# Altium schematic sheet PIC32ETH.SchDoc: Main
size A3; SheetNumber: 1
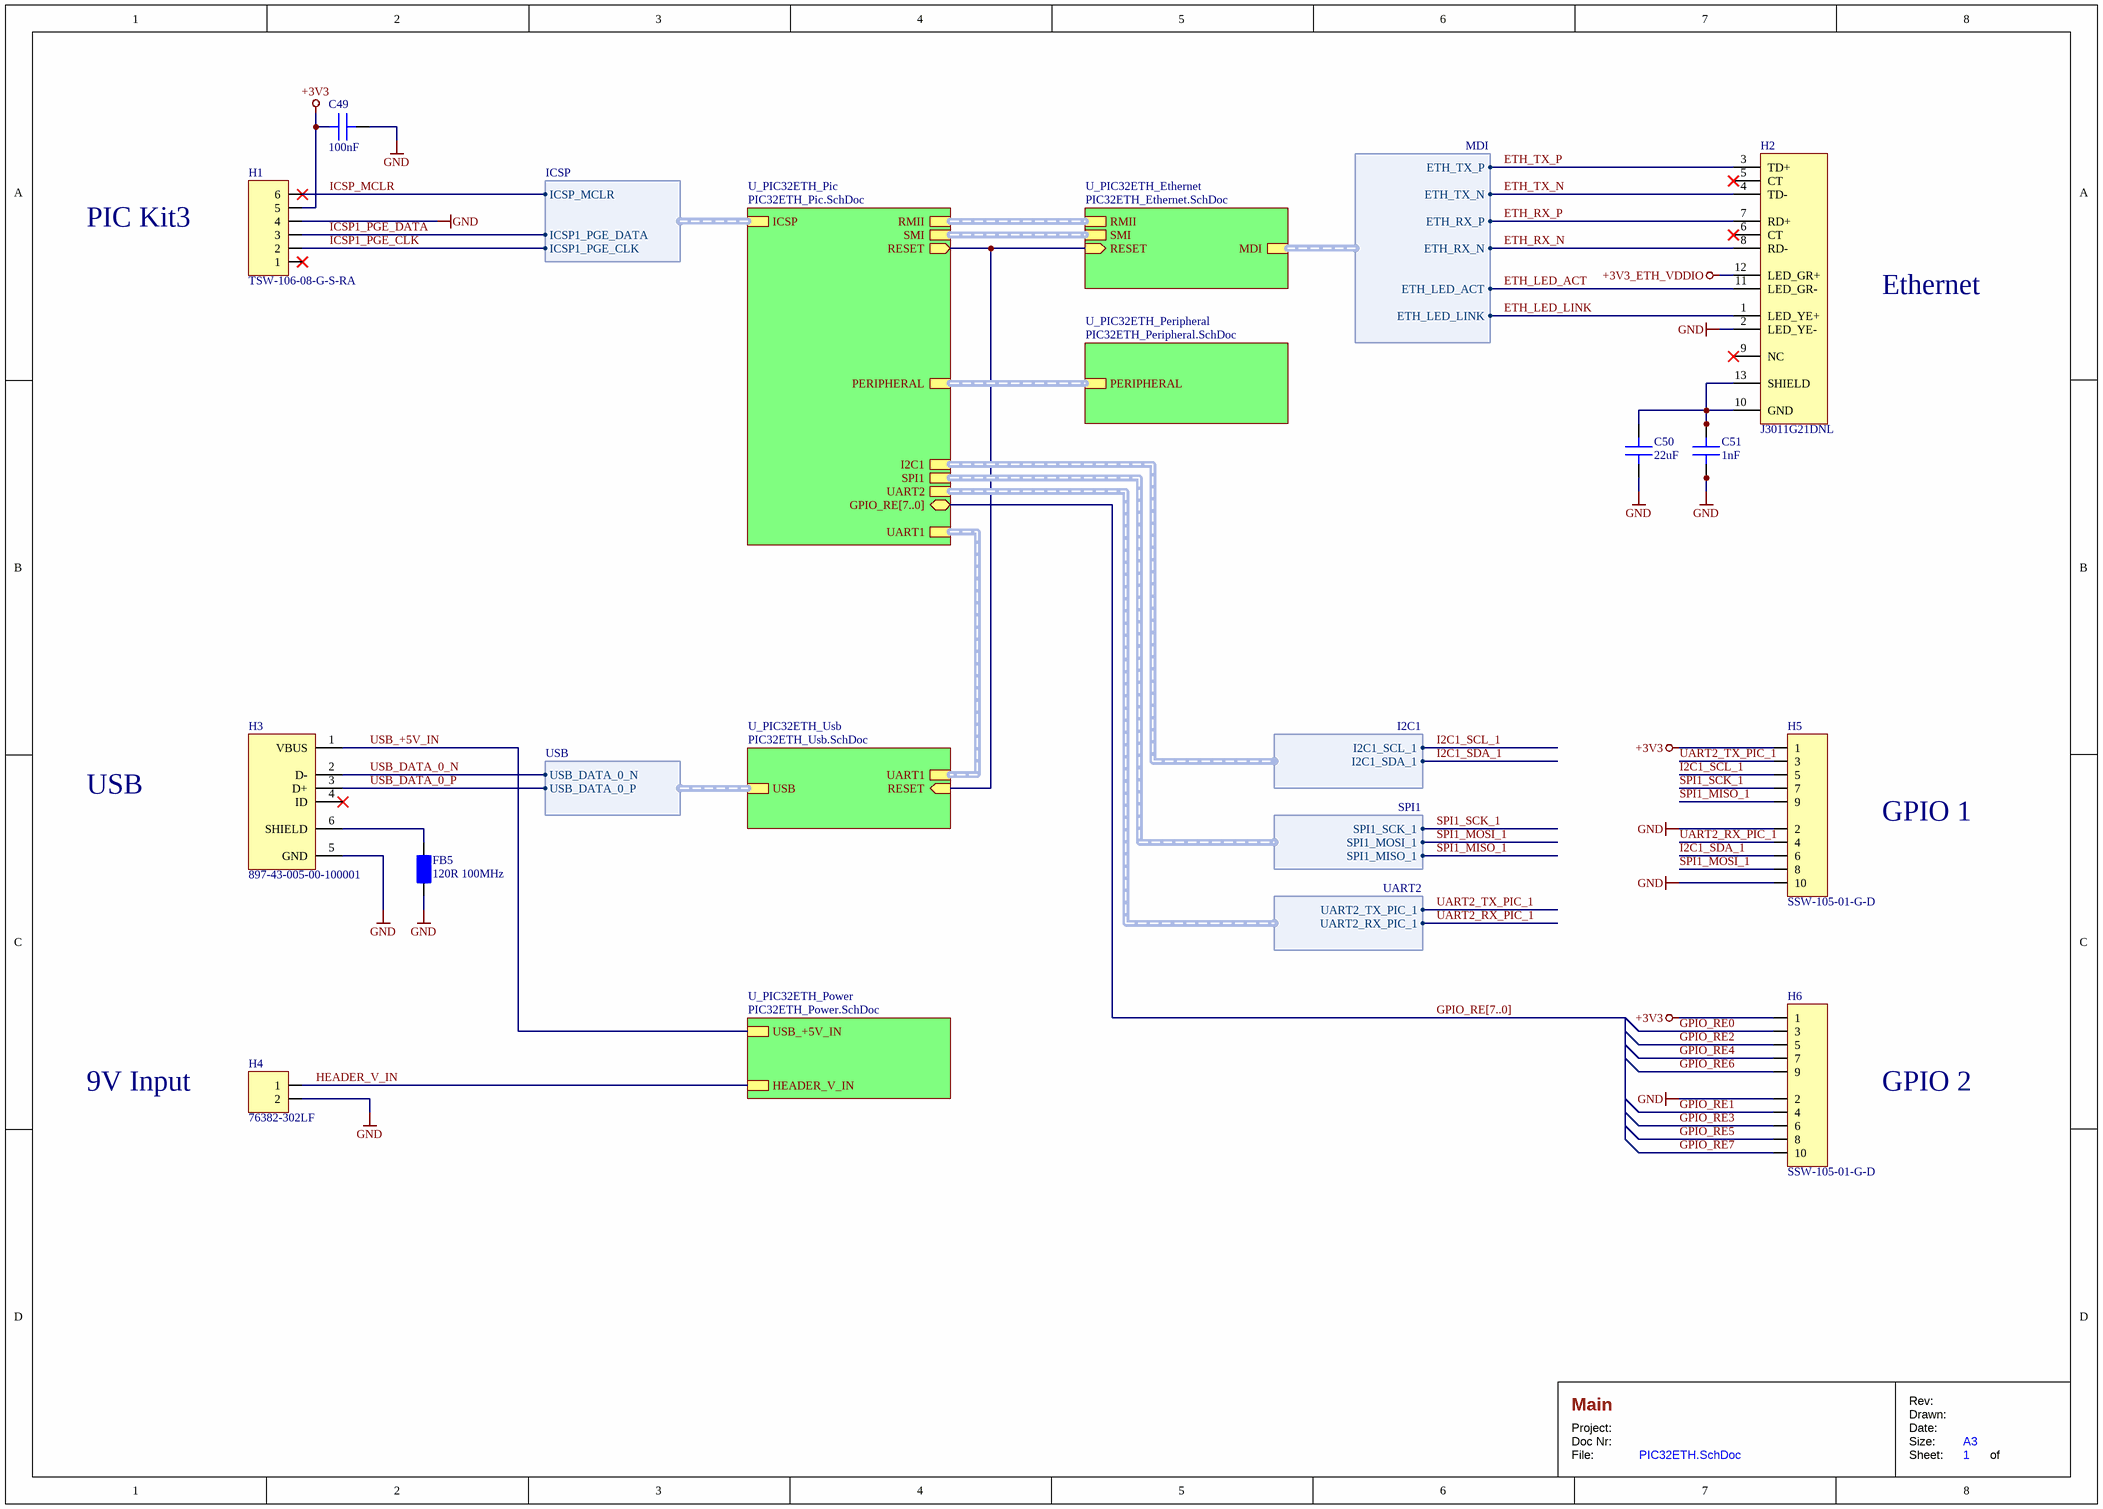
[diagram p0: PIC32ETH.SchDoc]

## Parts
C49  100nF  [C_CHIP2012N]
C50  22uF  [C_CHIP3216N]
C51  1nF  [C_CHIP2012N]
FB5  120R 100MHz  [FB_CHIP3216N]
H1  TSW-106-08-G-S-RA  [H_TSW-106-08-G-S-RA]
H2  J3011G21DNL  [H_J3011G21DNL]
H3  897-43-005-00-100001  [H_897-43-005-00-100001]
H4  76382-302LF  [H_76382-302LF]
H5  SSW-105-01-G-D  [H_SSW-105-01-G-D]
H6  SSW-105-01-G-D  [H_SSW-105-01-G-D]

## Sub-sheets
U_PIC32ETH_Ethernet = PIC32ETH_Ethernet.SchDoc: MDI (harness MDI), RMII (harness RMII), SMI (harness SMI), RESET (in)
U_PIC32ETH_Peripheral = PIC32ETH_Peripheral.SchDoc: PERIPHERAL (harness PERIPHERAL)
U_PIC32ETH_Pic = PIC32ETH_Pic.SchDoc: RMII (harness RMII), I2C1 (harness I2C1), UART2 (harness UART2), PERIPHERAL (harness PERIPHERAL), ICSP (harness ICSP), SPI1 (harness SPI1), UART1 (harness UART1), SMI (harness SMI), GPIO_RE[7..0] (bidir), RESET (out)
U_PIC32ETH_Power = PIC32ETH_Power.SchDoc: USB_+5V_IN, HEADER_V_IN
U_PIC32ETH_Usb = PIC32ETH_Usb.SchDoc: UART1 (harness UART1), USB (harness USB), RESET (in)

## Harnesses
MDI: ETH_TX_N, ETH_TX_P, ETH_RX_N, ETH_RX_P, ETH_LED_LINK, ETH_LED_ACT
UART2: UART2_RX_PIC_1, UART2_TX_PIC_1
SPI1: SPI1_MOSI_1, SPI1_SCK_1, SPI1_MISO_1
I2C1: I2C1_SDA_1, I2C1_SCL_1
ICSP: ICSP_MCLR, ICSP1_PGE_DATA, ICSP1_PGE_CLK
USB: USB_DATA_0_P, USB_DATA_0_N

## Nets
+3V3: C49.1 H1.5 H5.1 H6.1
+3V3_ETH_VDDIO: H2.12(LED_GR+)
GND: C49.2 C50.1 C51.1 FB5.2 H1.4 H2.2(LED_YE-) H3.5(GND) H4.2 H5.2 H5.10 H6.2
ETH_LED_ACT: H2.11(LED_GR-) ; sheet U_PIC32ETH_Ethernet/MDI.ETH_LED_ACT
ETH_LED_LINK: H2.1(LED_YE+) ; sheet U_PIC32ETH_Ethernet/MDI.ETH_LED_LINK
ETH_RX_N: H2.8(RD-) ; sheet U_PIC32ETH_Ethernet/MDI.ETH_RX_N
ETH_RX_P: H2.7(RD+) ; sheet U_PIC32ETH_Ethernet/MDI.ETH_RX_P
ETH_TX_N: H2.4(TD-) ; sheet U_PIC32ETH_Ethernet/MDI.ETH_TX_N
ETH_TX_P: H2.3(TD+) ; sheet U_PIC32ETH_Ethernet/MDI.ETH_TX_P
GPIO_RE0: H6.3
GPIO_RE1: H6.4
GPIO_RE2: H6.5
GPIO_RE3: H6.6
GPIO_RE4: H6.7
GPIO_RE5: H6.8
GPIO_RE6: H6.9
GPIO_RE7: H6.10
HEADER_V_IN: H4.1 ; sheet U_PIC32ETH_Power/HEADER_V_IN
I2C1_SCL_1: H5.5 ; sheet U_PIC32ETH_Pic/I2C1.I2C1_SCL_1
I2C1_SDA_1: H5.6 ; sheet U_PIC32ETH_Pic/I2C1.I2C1_SDA_1
ICSP1_PGE_CLK: H1.2 ; sheet U_PIC32ETH_Pic/ICSP.ICSP1_PGE_CLK
ICSP1_PGE_DATA: H1.3 ; sheet U_PIC32ETH_Pic/ICSP.ICSP1_PGE_DATA
ICSP_MCLR: H1.6 ; sheet U_PIC32ETH_Pic/ICSP.ICSP_MCLR
SPI1_MISO_1: H5.9 ; sheet U_PIC32ETH_Pic/SPI1.SPI1_MISO_1
SPI1_MOSI_1: H5.8 ; sheet U_PIC32ETH_Pic/SPI1.SPI1_MOSI_1
SPI1_SCK_1: H5.7 ; sheet U_PIC32ETH_Pic/SPI1.SPI1_SCK_1
UART2_RX_PIC_1: H5.4 ; sheet U_PIC32ETH_Pic/UART2.UART2_RX_PIC_1
UART2_TX_PIC_1: H5.3 ; sheet U_PIC32ETH_Pic/UART2.UART2_TX_PIC_1
USB_+5V_IN: H3.1(VBUS) ; sheet U_PIC32ETH_Power/USB_+5V_IN
USB_DATA_0_N: H3.2(D-) ; sheet U_PIC32ETH_Usb/USB.USB_DATA_0_N
USB_DATA_0_P: H3.3(D+) ; sheet U_PIC32ETH_Usb/USB.USB_DATA_0_P
NetC50_2: C50.2 C51.2 H2.10(GND) H2.13(SHIELD)
NetFB5_1: FB5.1 H3.6(SHIELD)
(unnamed): sheet U_PIC32ETH_Pic/RESET, sheet U_PIC32ETH_Ethernet/RESET, sheet U_PIC32ETH_Usb/RESET

Not connected (* = marked no-connect by the designer): H1 1*; H2 5(CT)* 6(CT)* 9(NC)*; H3 4(ID)*

## Buses and harness runs
bus GPIO_RE[7..0] = sheet U_PIC32ETH_Pic/GPIO_RE[7..0]
harness sheet U_PIC32ETH_Ethernet/RMII = sheet U_PIC32ETH_Pic/RMII
harness sheet U_PIC32ETH_Ethernet/SMI = sheet U_PIC32ETH_Pic/SMI
harness sheet U_PIC32ETH_Peripheral/PERIPHERAL = sheet U_PIC32ETH_Pic/PERIPHERAL
harness sheet U_PIC32ETH_Pic/UART1 = sheet U_PIC32ETH_Usb/UART1

## Notes on the sheet
- PIC Kit3
- Ethernet
- USB
- GPIO 1
- 9V Input
- GPIO 2
- Project:
- Doc Nr:
- File:
- Drawn:
- Rev:
- Date:
- Size:
- Sheet:
- A3
- of

## Library data of the parts
C49 = C_C0805C104K5RACTU: C CERAMIC 100nF 50V 10% 2012; Manufacturer: Kemet; Dielectric: X7R; Tolerance: +/-10%; Datasheet Url: https://content.kemet.com/datasheets/KEM_C1002_X7R_SMD.pdf; Mounting: SMT; Package: 2012; Part Number: C0805C104K5RACTU; Price: 0.23; Price Currency: CHF; Supplier 1: Digi-Key; Capacitance: 100nF; Voltage: 50V; Supplier Part Number 1: 399-1170-1-ND; Esr: n/a; Pin Count: 2; Temperature Range: -55degC to 125degC
C50 = C_C1206C226K8RAC7800: C CERAMIC 22uF 10V 10% 3216; Manufacturer: Kemet; Dielectric: X7R; Tolerance: +/-10%; Package: 3216; Supplier 1: Digi-Key; Part Number: C1206C226K8RAC7800; Temperature Range: -55degC to 125degC; Datasheet Url: https://api.kemet.com/component-edge/download/datasheet/C1206C226K8RAC7800.pdf; Mounting: SMT; Price: 0.65; Price Currency: CHF; Note: *; Capacitance: 22uF; Voltage: 10V; Pin Count: 2; Esr: n/a; Supplier Part Number 1: 399-11947-1-ND
C51 = C_C0805C102K5RACTU: C CERAMIC 1nF 50V 10% 2012; Manufacturer: Kemet; Dielectric: X7R; Tolerance: +/-10%; Datasheet Url: https://content.kemet.com/datasheets/KEM_C1002_X7R_SMD.pdf; Mounting: SMT; Package: 2012; Part Number: C0805C102K5RACTU; Price: 0.11; Price Currency: CHF; Supplier 1: Digi-Key; Capacitance: 1nF; Voltage: 50V; Supplier Part Number 1: 399-1147-1-ND; Esr: n/a; Pin Count: 2; Temperature Range: -55degC to 125degC
FB5 = FB_BLM31KN121SN1L: FB 120R 100MHz 6A 3216; Manufacturer: Murata Electronics; Resistance: 9mR; Datasheet Url: https://www.murata.com/en-us/products/productdata/8801529331742/ENFA0091.pdf; Mounting: SMT; Package: 3216; Part Number: BLM31KN121SN1L; Price: 0.29; Price Currency: CHF; Supplier 1: Digi-Key; Supplier Part Number 1: 490-16524-1-ND; Temperature Range: -55degC to 125degC; Pin Count: 2; Current: 6A; Impedance: 120R 100MHz
H1 = H_TSW-106-08-G-S-RA: H GENERAL HEADER 6POS 1ROW 2.54mm ANGLE THT; Manufacturer: Samtec Inc.; Current: 5.7A; Voltage: 550VAC, 770VDC; Positions: 6; Rows: 1; Datasheet URL: http://suddendocs.samtec.com/catalog_english/tsw_th.pdf; Mounting: THT; Package: n/a; Part Number: TSW-106-08-G-S-RA; Price: 0.68; Price Currency: CHF; Supplier 1: Digi-Key; Supplier Part Number 1: SAM1039-06-ND; Temperature Range: -55degC to 125degC; Pin Count: 6; Mating Cycles: n/a; Header Type: Header; Orientation: Angle; Spacing: 2.54mm
H2 = H_J3011G21DNL: H RJ45 SOCKET 1PORT ANGLE SMT; Manufacturer: Pulse; Ports: 1; Part Number: J3011G21DNL; Price Currency: CHF; Current: n/a; Datasheet URL: https://productfinder.pulseeng.com/doc_type/WEB301/doc_num/J409/doc_part/J409.pdf; Mating Cycles: n/a; Mounting: SMT; Package: n/a; Pin Count: 13; Price: 8.68; Temperature Range: 0°C to 70°C; Voltage: n/a; Header Type: Socket; Orientation: Angle; Supplier 1: Digi-Key; Supplier Part Number 1: 553-1491-ND
H3 = H_897-43-005-00-100001: H USB SOCKET 1PORT B-MINI ANGLE SMT; Manufacturer: Mill-Max Manufacturing Corp.; Mating Cycles: 5000; Current: 1A; Voltage: 30VAC; Ports: 1; Datasheet URL: http://www.farnell.com/datasheets/1734713.pdf?_ga=2.223747291.1932968036.1561574157-1154557334.1561574157&_gac=1.227804655.1561574157.CjwKCAjwr8zoBRA0EiwANmvpYNQHn877f_ACzLNOCpO9cVZHUYePGKu6J6mtcTAYQ9aGUVPIBV0ilRoC6_EQAvD_BwE; Mounting: SMT; Package: n/a; Part Number: 897-43-005-00-100001; Price: 1.21; Price Currency: CHF; Supplier 1: Digi-Key; Supplier Part Number 1: ED90341CT-ND; Pin Count: 6; Temperature Range: n/a; Header Type: Socket; Orientation: Angle; Usb Type: B-Mini
H4 = H_76382-302LF: H GENERAL HEADER 2POS 1ROW 2.54mm ANGLE THT; Manufacturer: Amphenol ICC; Current: 3A; Mating Cycles: 1000; Voltage: 1000V; Positions: 2; Rows: 1; Datasheet URL: https://cdn.amphenol-icc.com/media/wysiwyg/files/drawing/76382.pdf; Mounting: THT; Package: n/a; Part Number: 76382-302LF; Price: 0.71; Price Currency: CHF; Supplier 1: Digi-Key; Supplier Part Number 1: 609-1278-ND; Pin Count: 2; Temperature Range: -40degC to 125degC; Header Type: Header; Orientation: Angle; Spacing: 2.54mm
H5 H6 = H_SSW-105-01-G-D: H GENERAL SOCKET 10POS 2ROW 2.54mm VERTICAL THT; Manufacturer: Samtec Inc.; Current: 5.7A; Voltage: 465VAC, 655VDC; Positions: 10; Rows: 2; Datasheet URL: http://suddendocs.samtec.com/catalog_english/ssq_th.pdf; Mounting: THT; Package: n/a; Part Number: SSW-105-01-G-D; Price: 1.33; Price Currency: CHF; Supplier 1: Digi-Key; Supplier Part Number 1: SAM1208-05-ND; Temperature Range: -55degC to 125degC; Pin Count: 10; Mating Cycles: n/a; Header Type: Socket; Orientation: Vertical; Spacing: 2.54mm